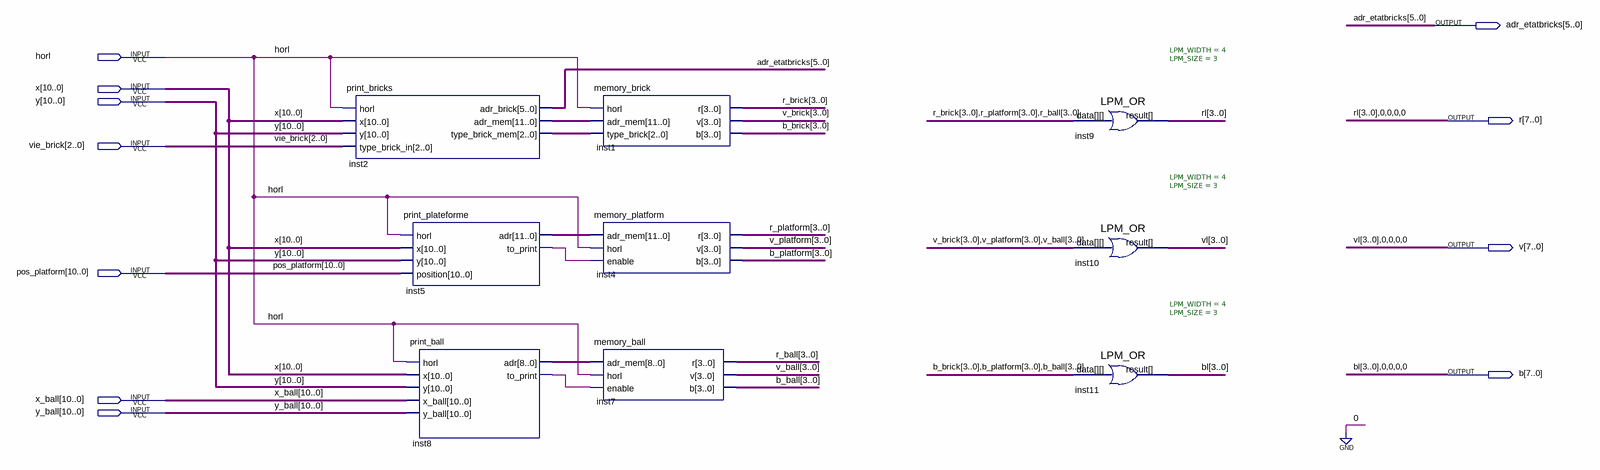
[diagram p0: schematic sheet]
// Quartus schematic afficheur.bdf as structural Verilog: 9 symbols, 11 pins
module afficheur (
  input  horl,
  input  [10:0] x,
  input  [10:0] y,
  input  [2:0] vie_brick,
  input  [10:0] pos_platform,
  input  [10:0] x_ball,
  input  [10:0] y_ball,
  output [5:0] adr_etatbricks,
  output [7:0] r,
  output [7:0] v,
  output [7:0] b
);

  wire inst5_to_print, inst8_to_print;
  wire [2:0] inst2_type_brick_mem;
  wire [3:0] b_ball, b_brick, b_platform, r_ball, r_brick, r_platform, v_ball, v_brick, v_platform;
  wire [8:0] inst8_adr;
  wire [11:0] inst2_adr_mem, inst5_adr;

  print_bricks inst2 (
    .horl(horl), .x(x), .y(y), .type_brick_in(vie_brick), .adr_brick(adr_etatbricks),
    .adr_mem(inst2_adr_mem), .type_brick_mem(inst2_type_brick_mem));
  print_plateforme inst5 (
    .horl(horl), .x(x), .y(y), .position(pos_platform), .adr(inst5_adr), .to_print(inst5_to_print));
  print_ball inst8 (
    .horl(horl), .x(x), .y(y), .x_ball(x_ball), .y_ball(y_ball), .adr(inst8_adr), .to_print(inst8_to_print));
  memory_brick inst1 (
    .horl(horl), .adr_mem(inst2_adr_mem), .type_brick(inst2_type_brick_mem), .r(r_brick), .v(v_brick),
    .b(b_brick));
  memory_platform inst4 (
    .adr_mem(inst5_adr), .horl(horl), .enable(inst5_to_print), .r(r_platform), .v(v_platform), .b(b_platform));
  memory_ball inst7 (.adr_mem(inst8_adr), .horl(horl), .enable(inst8_to_print), .r(r_ball), .v(v_ball), .b(b_ball));
  LPM_OR #(.LPM_WIDTH(4), .LPM_SIZE(3)) inst9 (.data({r_brick, r_platform, r_ball}), .result(r[7:4]));
  LPM_OR #(.LPM_WIDTH(4), .LPM_SIZE(3)) inst10 (.data({v_brick, v_platform, v_ball}), .result(v[7:4]));
  LPM_OR #(.LPM_WIDTH(4), .LPM_SIZE(3)) inst11 (.data({b_brick, b_platform, b_ball}), .result(b[7:4]));

  assign b[3:0] = 4'b0000;
  assign r[3:0] = 4'b0000;
  assign v[3:0] = 4'b0000;

  // Other names for the same wires on the sheet: bl[3:0] = b[7:4]; rl[3:0] = r[7:4]; vl[3:0] = v[7:4]
endmodule
